# EAGLE schematic INPUT OUTPUT BOTTOM (EAGLE 9.0.0)
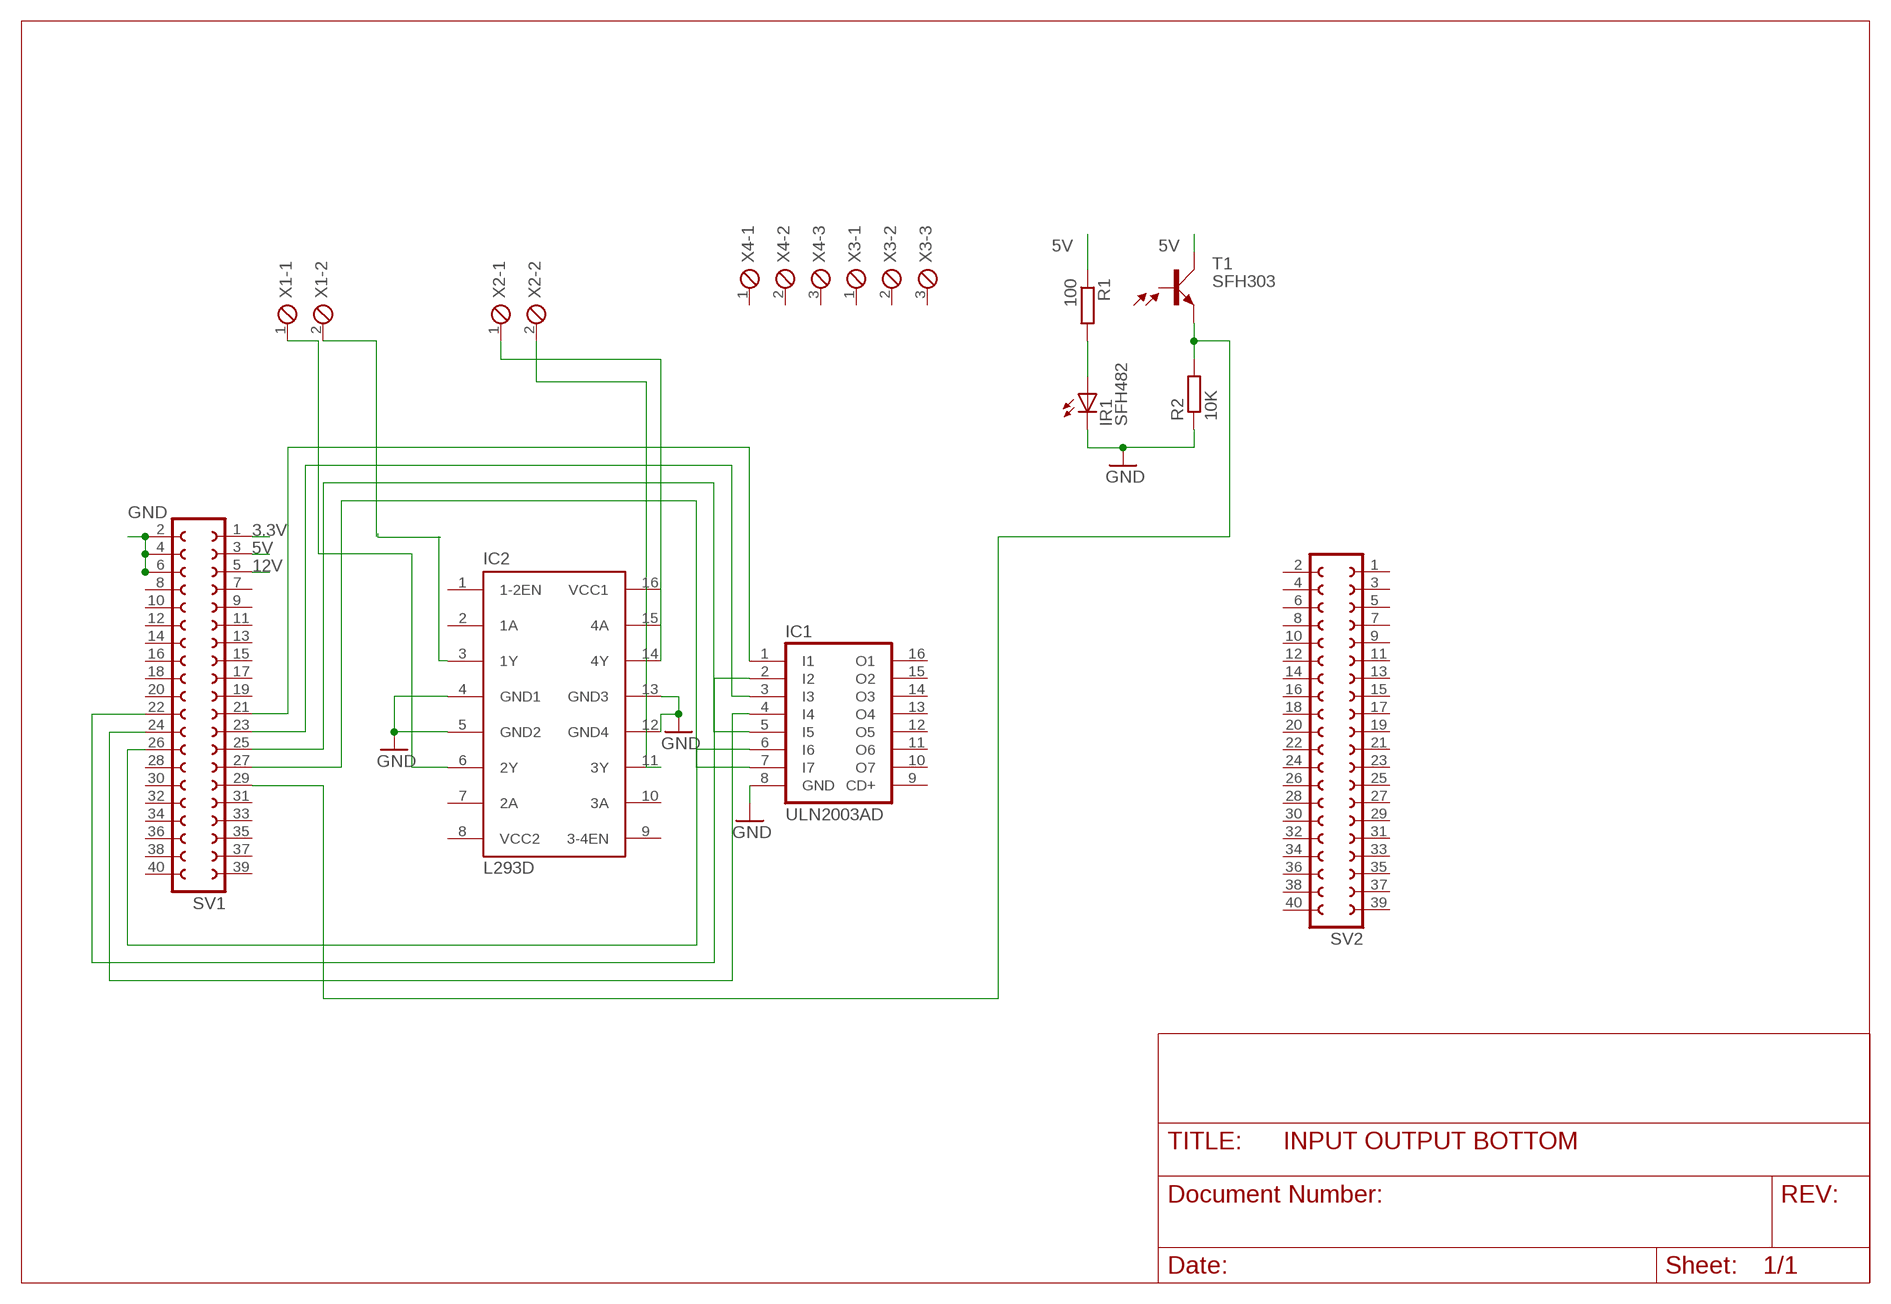
[diagram p0: schematic, sheet 1]

## Parts
IC1  ULN2003AD  [SO16]
IC2  L293D  [DIL16]
IR1  SFH482  [SFH482]
R1  100  R-EU_R3225  [R3225]
R2  10K  R-EU_R3225  [R3225]
SV1  FE20-2  [FE20-2]
SV2  FE20-2  [FE20-2]
T1  SFH303  [SFH303]
X1  MPT2  [2POL254]
X2  MPT2  [2POL254]
X3  MPT3  [3POL254]
X4  MPT3  [3POL254]

## Nets
3.3V: SV1.1
5V: R1.1 SV1.3 T1.2(C)
12V: SV1.5
GND: IC1.8(GND) IC2.4(GND1) IC2.5(GND2) IC2.12(GND4) IC2.13(GND3) IR1.K(C) R2.1 SV1.2 SV1.4 SV1.6
N$1: IC1.1(I1) SV1.21
N$2: IC1.2(I2) SV1.22
N$3: IC1.3(I3) SV1.23
N$4: IC1.4(I4) SV1.24
N$5: IC1.5(I5) SV1.25
N$6: IC1.6(I6) SV1.26
N$7: IC1.7(I7) SV1.27
N$8: IR1.A R1.2
N$9: R2.2 SV1.29 T1.1(E)
N$10: X1.2
N$11: IC2.6(2Y) X1.1
N$12: IC2.11(3Y) X2.2
N$13: IC2.14(4Y) X2.1
N$14: IC2.3(1Y)
Unconnected: IC1.9(CD+) IC1.10(O7) IC1.11(O6) IC1.12(O5) IC1.13(O4) IC1.14(O3) IC1.15(O2) IC1.16(O1) IC2.1(1-2EN) IC2.2(1A) IC2.7(2A) IC2.9(3-4EN) IC2.10(3A) IC2.15(4A) SV1.7 SV1.8 SV1.9 SV1.10 SV1.11 SV1.12 SV1.13 SV1.14 SV1.15 SV1.16 SV1.17 SV1.18 SV1.19 SV1.20 SV1.28 SV1.30 SV1.31 SV1.32 SV1.33 SV1.34 SV1.35 SV1.36 SV1.37 SV1.38 SV1.39 SV1.40 SV2.1 SV2.2 SV2.3 SV2.4 SV2.5 SV2.6 SV2.7 SV2.8 SV2.9 SV2.10 SV2.11 SV2.12 SV2.13 SV2.14 SV2.15 SV2.16 SV2.17 SV2.18 SV2.19 SV2.20 SV2.21 SV2.22 SV2.23 SV2.24 SV2.25 SV2.26 SV2.27 SV2.28 SV2.29 SV2.30 SV2.31 SV2.32 SV2.33 SV2.34 SV2.35 SV2.36 SV2.37 SV2.38 SV2.39 SV2.40 T1.3(B) X3.1 X3.2 X3.3 X4.1 X4.2 X4.3

## Power pins joined to a net without a drawn wire
VCC1: IC2.16(VCC1)
VCC2: IC2.8(VCC2)

## Library data of the parts
IC1 = uln-udn:ULN2003A: DRIVER ARRAY
IC2 = st-microelectronics:L293D: PUSH-PULL 4 CHANNEL DRIVER; MPN: L293D; OC_FARNELL: 9589619; OC_NEWARK: 56P8249
IR1 = led:SFH482: IR LED infrared emitting diode, Infineon
R1 R2 = resistor:R-EU_: RESISTOR, European symbol
SV1 SV2 = con-lsta:FE20-2: FEMALE HEADER; OC_FARNELL: unknown; OC_NEWARK: unknown
T1 = opto-trans-siemens:SFH303: Silicium NPN Phototransistor Source: Siemens; OC_FARNELL: unknown; OC_NEWARK: unknown
X1 X2 = con-phoenix-254:MPT2: PHOENIX CONNECTOR; OC_FARNELL: unknown; OC_NEWARK: unknown
X3 X4 = con-phoenix-254:MPT3: PHOENIX CONNECTOR; OC_FARNELL: unknown; OC_NEWARK: unknown